# EAGLE schematic electronic piano (EAGLE 6.5.0)
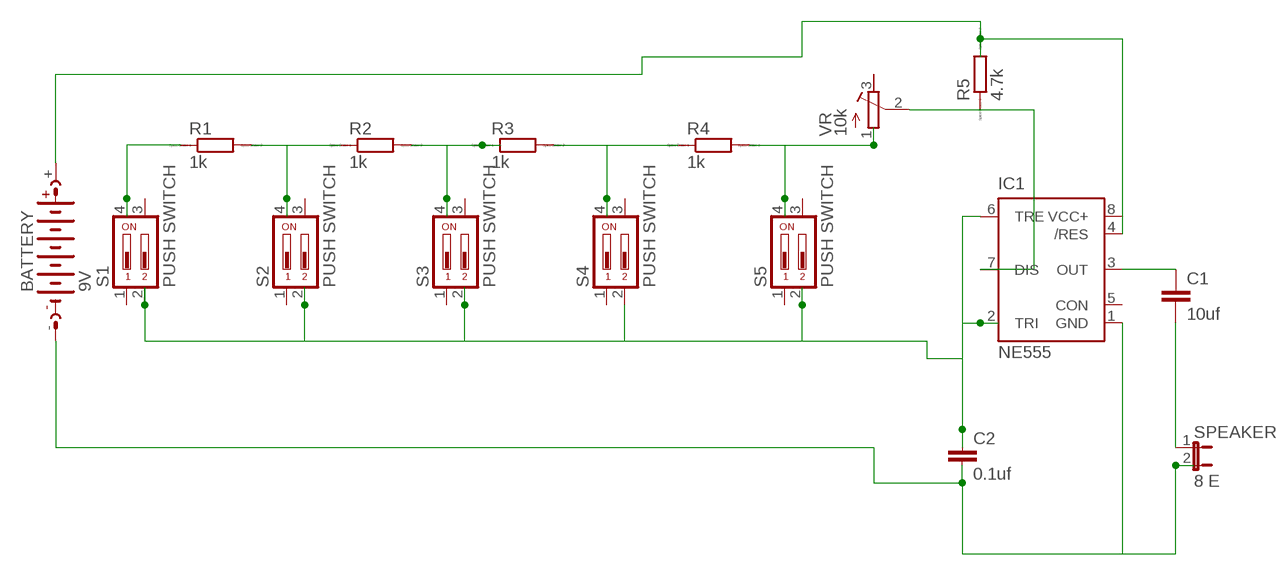
[diagram p0: schematic, sheet 1]

## Parts
BATTERY  9V  AB9V  [AB9V]
C1  10uf  C5/7.2  [C5B7.2]
C2  0.1uf  C2.5/2  [C2.5-2]
IC1  NE555  [DIL-08]
R1  1k  R0204/7  [0204/7]
R2  1k  R0204/7  [0204/7]
R3  1k  R0204/7  [0204/7]
R4  1k  R0204/7  [0204/7]
R5  4.7k  R0204/7  [0204/7]
S1  PUSH SWITCH  DS02  [DS-02]
S2  PUSH SWITCH  DS02  [DS-02]
S3  PUSH SWITCH  DS02  [DS-02]
S4  PUSH SWITCH  DS02  [DS-02]
S5  PUSH SWITCH  DS02  [DS-02]
SPEAKER  8 E  JP1E  [JP1]
VR  10k  R-TRIMM64P  [RTRIM64P]

## Nets
N$1: R1.1 S1.4
N$2: R1.2 R2.1 S2.4
N$3: R3.2 R4.1 S4.4
N$4: R4.2 S5.4 VR.1(E)
N$5: R2.2 R3.1 S3.4
N$6: IC1.7(DIS) R5.1 VR.2(S)
N$7: C2.1 IC1.2(TRI) IC1.6(TRE) S1.2 S2.2 S3.2 S4.2 S5.2
N$10: C1.1 IC1.3(OUT)
N$11: BATTERY.+ IC1.4(/RES) IC1.8(VCC+) R5.2
N$12: BATTERY.- C2.2 IC1.1(GND) SPEAKER.2
N$13: C1.2 SPEAKER.1
Unconnected: IC1.5(CON) S1.1 S1.3 S2.1 S2.3 S3.1 S3.3 S4.1 S4.3 S5.1 S5.3 VR.3(A)

## Library data of the parts
BATTERY = battery:AB9V: 9-V BATTERY CLIP
C1 C2 = capacitor-wima:C: CAPACITOR naming: grid - package width
IC1 = st-microelectronics:NE555: General purpose bipolar Timer; MF: Arrow Electronics; MPN: NE555N; OC_FARNELL: 1467742; OC_NEWARK: 89K1486
R1-R5 = eagle-ltspice:R: RESISTOR, European symbol; SPICEMODEL: NONE; SPICEPREFIX: R
S1-S5 = switch-dil:DS02: DIL/CODE SWITCH; OC_FARNELL: 9472126; OC_NEWARK: unknown
SPEAKER = jumper:JP1E: JUMPER
VR = resistor:R-TRIMM: Trimm resistor